# Altium schematic sheet MPU.SchDoc
size A
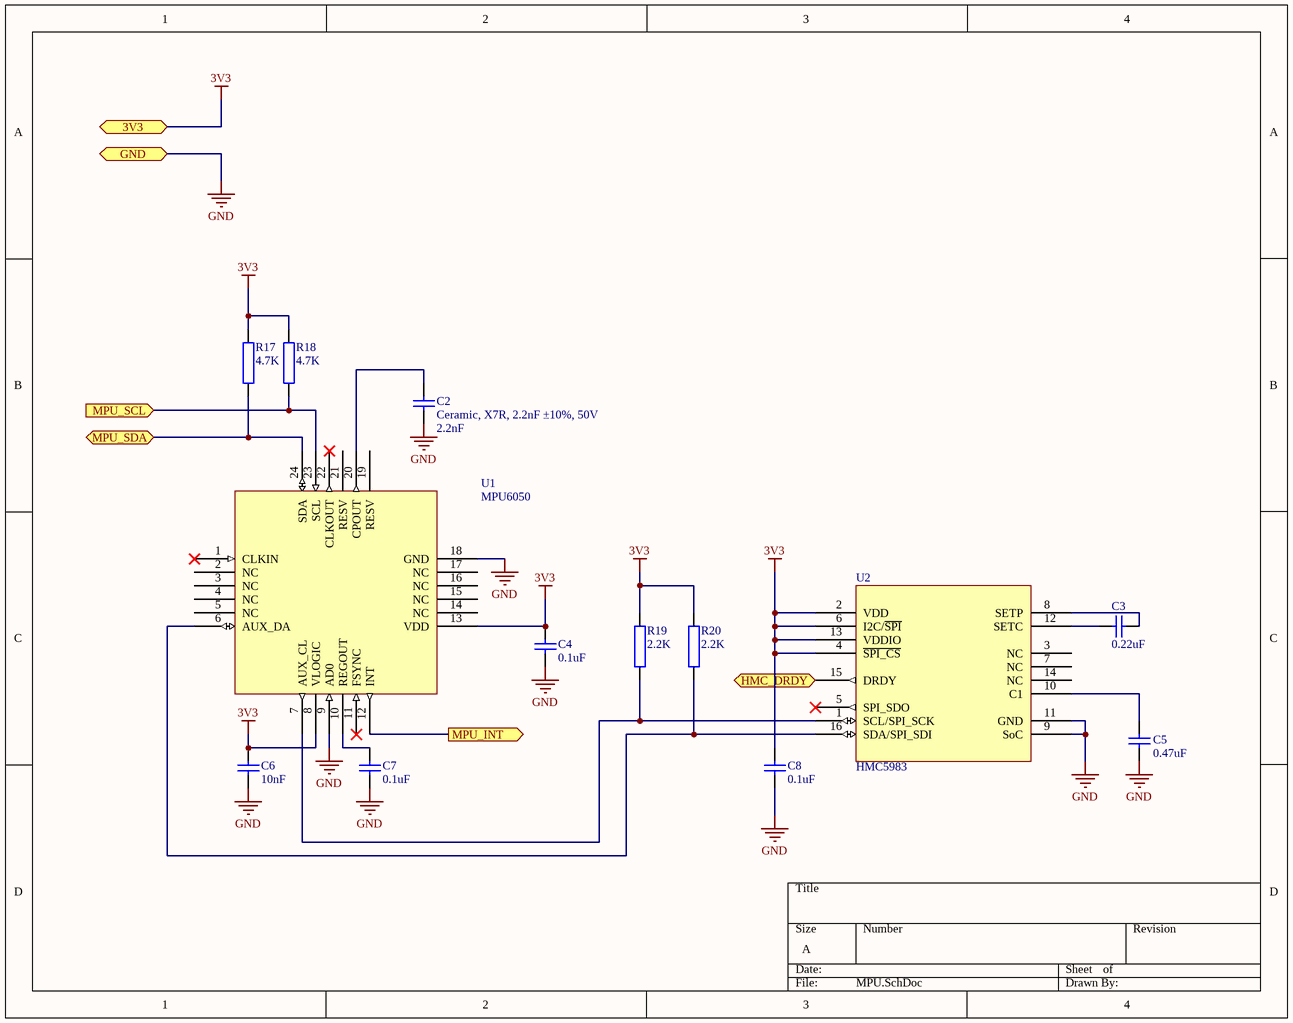
[diagram p0: MPU.SchDoc]

## Parts
C2  Ceramic, X7R, 2.2nF ±10%, 50V  value 2.2nF  [C0603]
C3  0.22uF  [C0603]
C4  0.1uF  [C0603]
C5  0.47uF  [C0603]
C6  10nF  [C0603]
C7  0.1uF  [C0603]
C8  0.1uF  [C0603]
R17  4.7K  [R0603]
R18  4.7K  [R0603]
R19  2.2K  [R0603]
R20  2.2K  [R0603]
U1  MPU6050  [24 Lead QFN]
U2  HMC5983  [16 Lead QFN 2]

## Ports
3V3, GND, HMC_DRDY (out), MPU_INT (out), MPU_SCL (in), MPU_SDA (bidir)

## Nets
3V3: C4.2 C6.2 C8.2 R17.2 R18.2 R19.2 R20.2 U1.8(VLOGIC) U1.13(VDD) U2.2(VDD) U2.4(~{SPI_CS}) U2.6(I2C/~{SPI}) U2.13(VDDIO) ; port 3V3
GND: C2.1 C4.1 C5.1 C6.1 C7.1 C8.1 U1.9(AD0) U1.18(GND) U2.9(SoC) U2.11(GND) ; port GND
HMC_DRDY: U2.15(DRDY) ; port HMC_DRDY
MPU_INT: U1.12(INT) ; port MPU_INT
MPU_SCL: R18.1 U1.23(SCL) ; port MPU_SCL
MPU_SDA: R17.1 U1.24(SDA) ; port MPU_SDA
NetC2_2: C2.2 U1.20(CPOUT)
NetC3_1: C3.1 U2.8(SETP)
NetC3_2: C3.2 U2.12(SETC)
NetC5_2: C5.2 U2.10(C1)
NetC7_2: C7.2 U1.10(REGOUT)
NetR19_1: R19.1 U1.7(AUX_CL) U2.1(SCL/SPI_SCK)
NetR20_1: R20.1 U1.6(AUX_DA) U2.16(SDA/SPI_SDI)

Not connected (* = marked no-connect by the designer): U1 1(CLKIN)* 2(NC) 3(NC) 4(NC) 5(NC) 11(FSYNC)* 14(NC) 15(NC) 16(NC) 17(NC) 19(RESV) 21(RESV) 22(CLKOUT)*; U2 3(NC) 5(SPI_SDO)* 7(NC) 14(NC)

## Library data of the parts
C2-C8 = Cap: Capacitor (Semiconductor SIM Model); Published: 8-Jun-2000; LatestRevisionDate: 29-May-2009; LatestRevisionNote: IPC-7351 Footprint Added.; PackageReference: C0603; Publisher: Altium Limited; PackageDescription: Chip Capacitor
  C3: Value: 0.22uF
  C4 C7 C8: Value: 0.1uF
  C5: Value: 0.47uF
  C6: Value: 10nF
R17-R20 = Res3: Resistor; Published: 8-Jun-2000; LatestRevisionDate: 29-May-2009; LatestRevisionNote: IPC-7351 Footprint Added.; PackageReference: R0603; Publisher: Altium Limited; PackageDescription: Chip Resistor
  R17 R18: Value: 4.7K
  R19 R20: Value: 2.2K
U1 = MPU6050: MPU6050, 24pin
U2 = HMC5983: HMC5983, 16pin